# Altium schematic sheet PC104-52-52.SchDoc
size 420 x 297 mm; SheetNumber: 17; SheetTotal: 21; ENG_APP_DATE: --/--/--; DSN_APP_DATE: --/--/--; CHK_APP_DATE: --/--/--
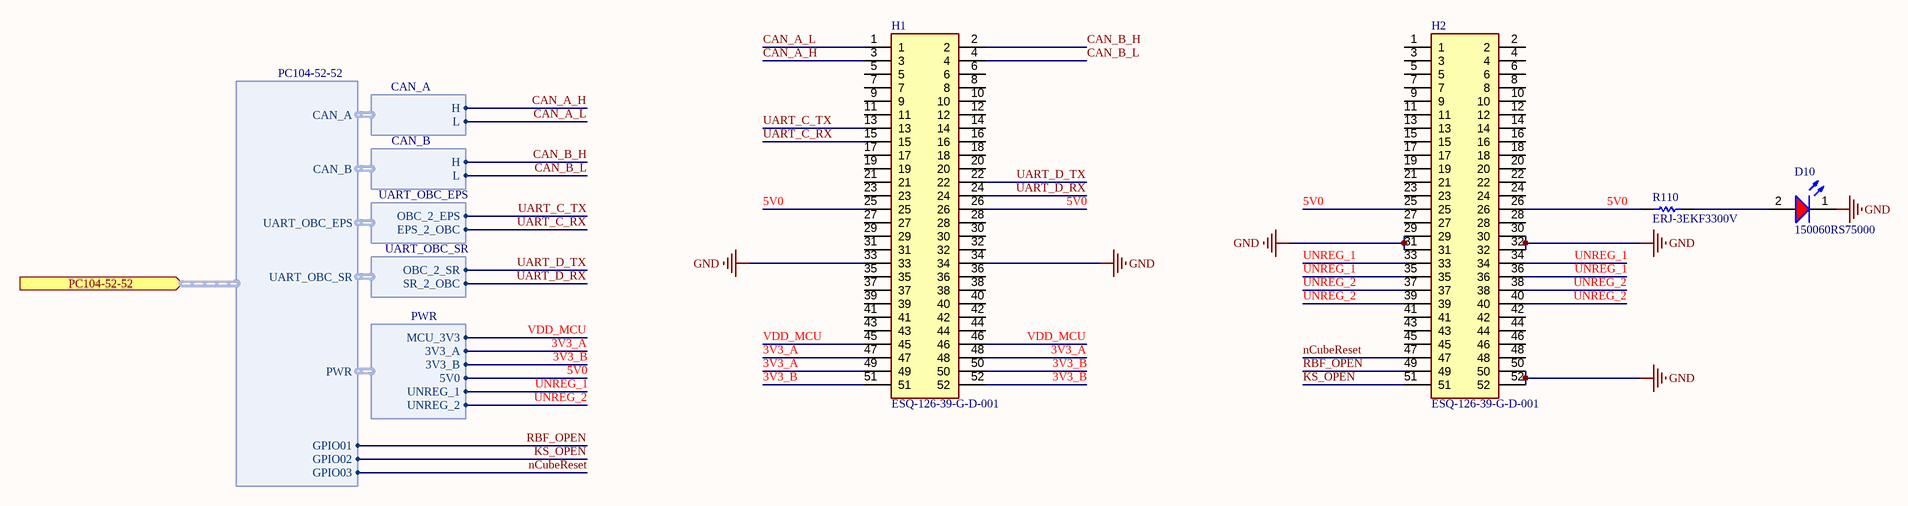
[diagram p0: PC104-52-52.SchDoc]

## Parts
D10  150060RS75000  [WL-SMCW_0603_150060xx75000]
H1  ESQ-126-39-G-D-001  [RHDR52W64P254_2X26_6654X495X1135P]
H2  ESQ-126-39-G-D-001  [RHDR52W64P254_2X26_6654X495X1135P]
R110  ERJ-3EKF3300V  [RESC1608X55X30LL15T15]

## Ports
PC104-52-52 (in, harness PC104-52-52)

## Harnesses
PC104-52-52: CAN_A, CAN_B, UART_OBC_SR, UART_OBC_EPS, PWR, GPIO01, GPIO02, GPIO03
CAN_A: L, H
CAN_B: L, H
PWR: MCU_3V3, 3V3_A, 3V3_B, 5V0, UNREG_1, UNREG_2
UART_OBC_SR: OBC_2_SR, SR_2_OBC
UART_OBC_EPS: EPS_2_OBC, OBC_2_EPS

## Nets
GND: D10.1(K) H1.33 H1.34 H2.29 H2.30 H2.31 H2.32 H2.50 H2.52
3V3_A: H1.47 H1.48 H1.49 ; harness PWR.3V3_A
3V3_B: H1.50 H1.51 H1.52 ; harness PWR.3V3_B
5V0: H1.25 H1.26 H2.25 H2.26 R110.1 ; harness PWR.5V0
CAN_A_H: H1.3 ; harness CAN_A.H
CAN_A_L: H1.1 ; harness CAN_A.L
CAN_B_H: H1.2 ; harness CAN_B.H
CAN_B_L: H1.4 ; harness CAN_B.L
KS_OPEN: H2.51 ; port PC104-52-52.GPIO02
nCubeReset: H2.47 ; port PC104-52-52.GPIO03
RBF_OPEN: H2.49 ; port PC104-52-52.GPIO01
UART_C_RX: H1.15 ; harness UART_OBC_EPS.EPS_2_OBC
UART_C_TX: H1.13 ; harness UART_OBC_EPS.OBC_2_EPS
UART_D_RX: H1.24 ; harness UART_OBC_SR.SR_2_OBC
UART_D_TX: H1.22 ; harness UART_OBC_SR.OBC_2_SR
UNREG_1: H2.33 H2.34 H2.35 H2.36 ; harness PWR.UNREG_1
UNREG_2: H2.37 H2.38 H2.39 H2.40 ; harness PWR.UNREG_2
VDD_MCU: H1.45 H1.46 ; harness PWR.MCU_3V3
NetD10_2: D10.2(A) R110.2

Not connected (* = marked no-connect by the designer): H1 5 6 7 8 9 10 11 12 14 16 17 18 19 20 21 23 27 28 29 30 31 32 35 36 37 38 39 40 41 42 43 44; H2 1 2 3 4 5 6 7 8 9 10 11 12 13 14 15 16 17 18 19 20 21 22 23 24 27 28 41 42 43 44 45 46 48

## Notes on the sheet
- THIS DOCUMENT AND THE DATA DISCLOSED HEREIN OR
- HEREWITH IS THE PROPERTY OF ALTIUM LIMITED AND MAY
- DWG NO:
- REVISION
- REV:
- DESCRIPTION
- DATE
- APPROVED
- BE FREELY DISTRIBUTED IN WHOLE. NO RIGHTS ARE
- RESERVED OR EXPRESS OR IMPLIED WARANTEE GIVEN.
- ENG:
- APPROVALS
- PROJECT
- DSN:
- CHK:
- REFERENCE DOCUMENTS
- PROJECT REVISION:
- TITLE
- DOCUMENT REVISION:
- DESIGN ITEM:
- BOM:
- FAB DWG:
- PCB DWG:
- ASSY DWG:
- SCALE:
- A3
- SIZE
- CAGE CODE
- FILE NAME
- DWG NO.
- SHEET
- OF
- REV

## Library data of the parts
D10 = CMP-1426-00001-4: LED Low-Power Uni-Color Red 630nm 2V 2-Pin Chip 0603(1608Metric) T/R; Max Junction Temperature (Tj): 95°C; Dominant Wavelength: 625nm; Lens Style: Clear, Rectangular; Viewing Angle: 140°; Forward Current: 100mA; Max Reverse Voltage (DC): 5V; Luminous Intensity: 250mcd; Test Current: 20mA; Power Dissipation: 72mW; Max Operating Temperature: 85°C; Mount: Surface Mount; Height: 700µm; Packaging: Tape and Reel; REACH SVHC: Unknown; Case Code (Metric): 1608; Peak Wavelength: 630nm; Forward Voltage: 2V; Case/Package: 0603; Color: Red; RoHS: Compliant; Width: 800µm; Reverse Voltage: 5V; Min Operating Temperature: -40°C; Wavelength: 625nm; Case Code (Imperial): 0603; Length: 1.6mm
H1 H2 = CMP-002-00086-1: PC / 104 Connectors Elevated Socket Strip; Manufacturer_Name: SAMTEC; Design Item ID: ESQ-126-39-G-D-001; Mouser Price/Stock: https://www.mouser.co.uk/ProductDetail/Samtec/ESQ-126-39-G-D-001?qs=PB6%2FjmICvI2K%2FCIgL4SVbg%3D%3D; Mouser Part Number: 200-ESQ12639GD001; Source: SamacSys.SchLib; Arrow Price/Stock: https://www.arrow.com/en/products/esq-126-39-g-d-001/samtec?region=nac; Arrow Part Number: ESQ-126-39-G-D-001; Manufacturer_Part_Number: ESQ-126-39-G-D-001; Datasheet Link: http://suddendocs.samtec.com/catalog_english/esq_th.pdf; Height: 11.35mm
R110 = CMP-2000-00435-2: Chip Resistor, 330 Ohm, +/- 1%, 0.1 W, -55 to 155 degC, 0603 (1608 Metric), RoHS, Tape and Reel; Gender: Male; Mating Cycles: 10000; Current Rating: 500 mA; Voltage Rating: 10 V; REACH SVHC: No SVHC; PackageDescription: 2-Pin Surface Mount Device, Body 1.6 x 0.85 mm; Contact Finish: Gold; Pins: 8; ComponentLink1Description: Manufacturer URL; Packaging: Tape and Reel; Max Operating Temperature: 85 degC; Contact Material: Copper; Height: 1.45 mm; Width: 1.45 mm; DatasheetVersion: Apr-15; Package Quantity: 1500; Contact Plating: Gold; PackageReference: 0603; Mount: Surface Mount; Lead Pitch: 1.1 mm; Min Operating Temperature: -25 degC; ComponentLink1URL: http://www.panasonic.com/; ComponentLink2URL: http://industrial.panasonic.com/cdbs/www-data/pdf/RDA0000/AOA0000C86.pdf; Length: 13.7 mm; ComponentLink2Description: Datasheet; RoHSCompliant: true